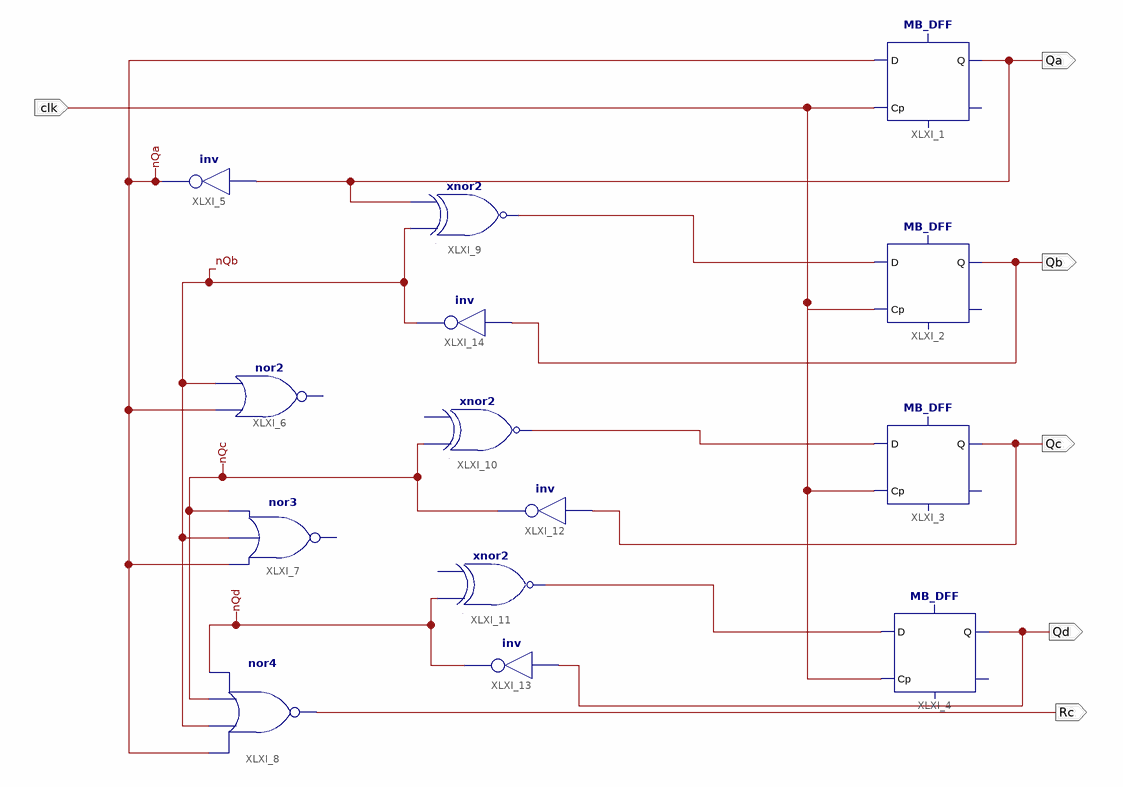
[diagram p0: schematic sheet 1]
// Xilinx ISE schematic Counter_4bit.sch (kintex7) as structural Verilog: 14 symbols, 6 ports
module Counter_4bit (
  input  clk,
  output Qa,
  output Qb,
  output Qc,
  output Qd,
  output Rc
);

  wire nQa, nQb, nQc, nQd, XLXN_21, XLXN_22, XLXN_23;

  MB_DFF XLXI_1 (.D(nQa), .Cp(clk), .Q(Qa));  // open: Sn, Rn, Qn
  MB_DFF XLXI_2 (.D(XLXN_23), .Cp(clk), .Q(Qb));  // open: Sn, Rn, Qn
  MB_DFF XLXI_3 (.D(XLXN_22), .Cp(clk), .Q(Qc));  // open: Sn, Rn, Qn
  MB_DFF XLXI_4 (.D(XLXN_21), .Cp(clk), .Q(Qd));  // open: Sn, Rn, Qn
  not XLXI_5 (nQa, Qa);
  // nor2 XLXI_6 has open pins: I0=nQa, I1=nQb, O=open
  // nor3 XLXI_7 has open pins: I0=nQa, I1=nQb, I2=nQc, O=open
  nor XLXI_8 (Rc, nQa, nQb, nQc, nQd);
  xnor XLXI_9 (XLXN_23, nQb, Qa);
  not XLXI_10 (XLXN_22, nQc);  // xnor2 open: I1
  not XLXI_11 (XLXN_21, nQd);  // xnor2 open: I1
  not XLXI_12 (nQc, Qc);
  not XLXI_13 (nQd, Qd);
  not XLXI_14 (nQb, Qb);
endmodule
